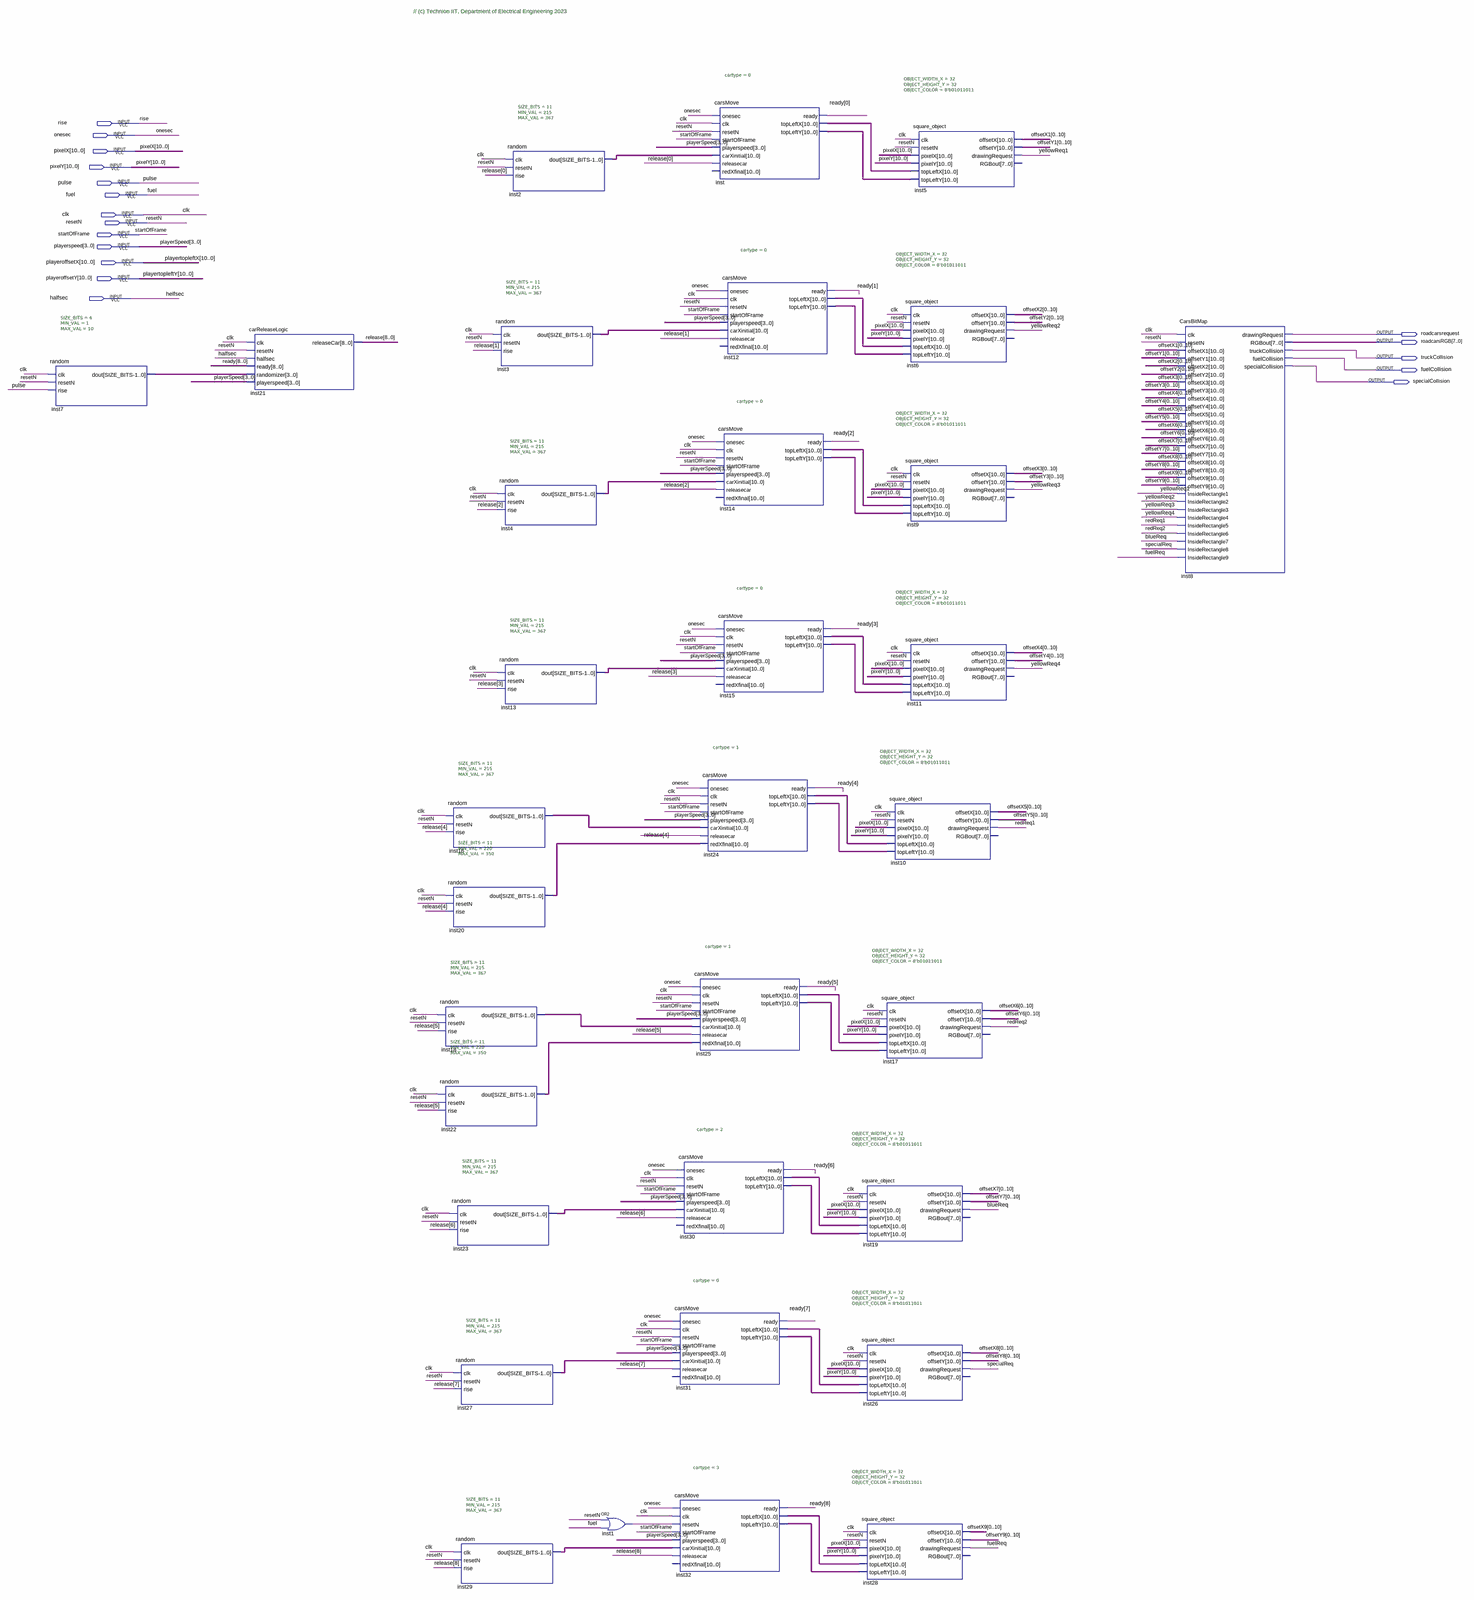
[diagram p0: schematic sheet, whole]
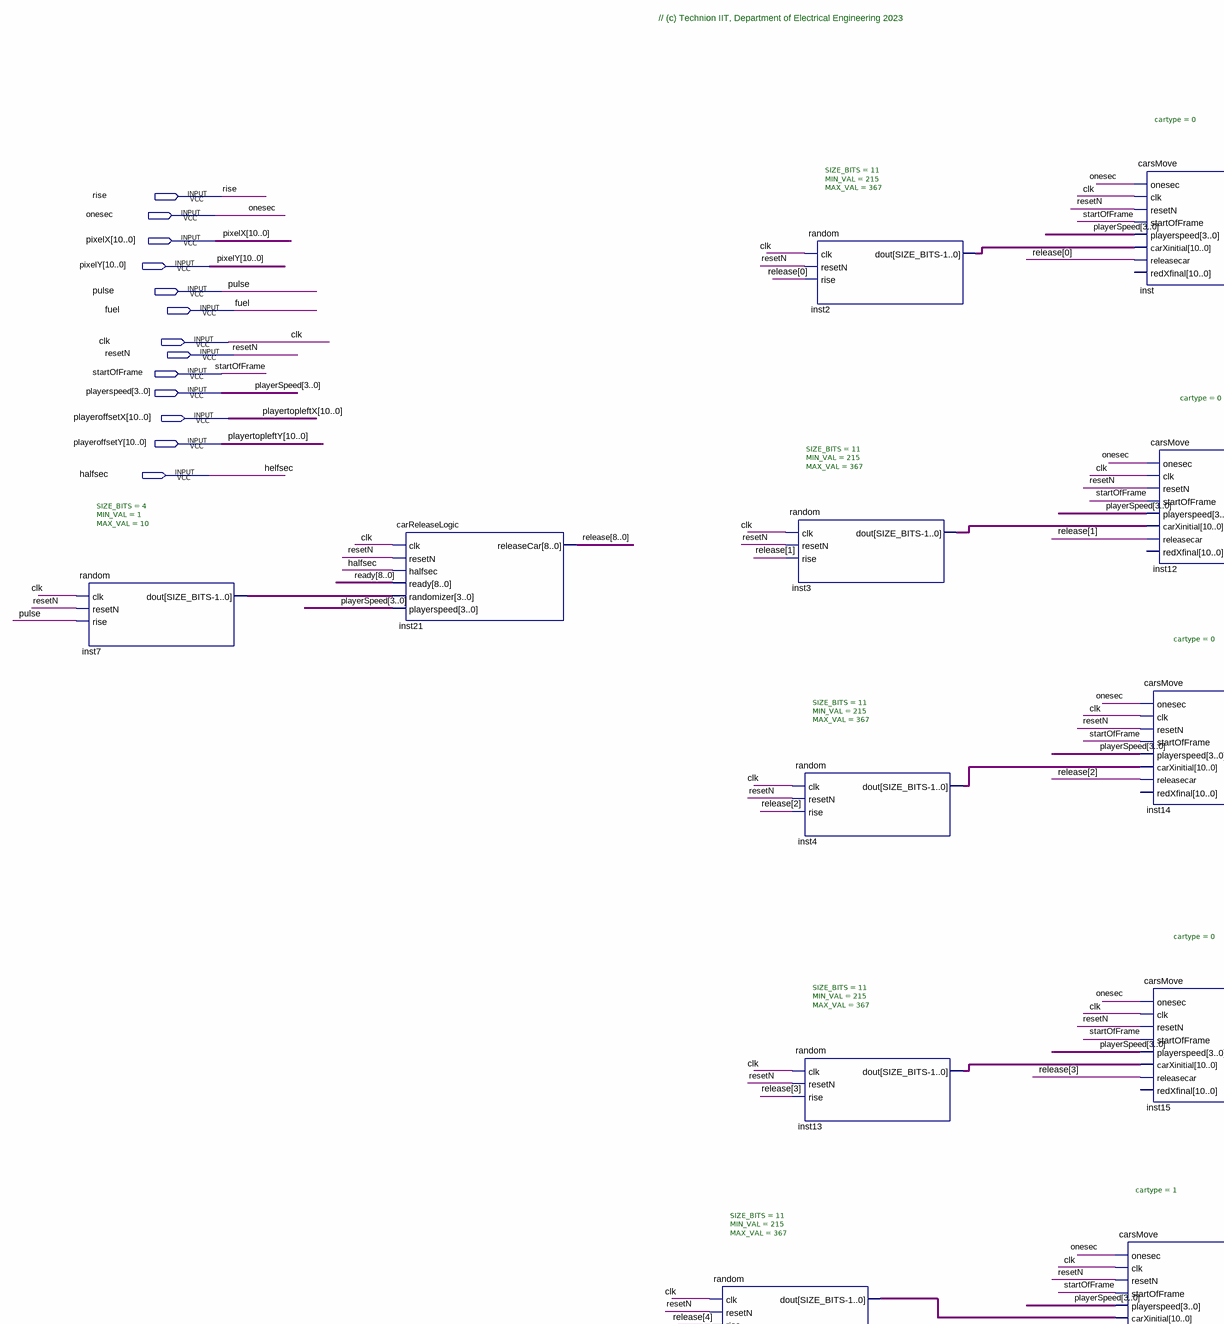
[diagram p1: schematic sheet, upper left part]
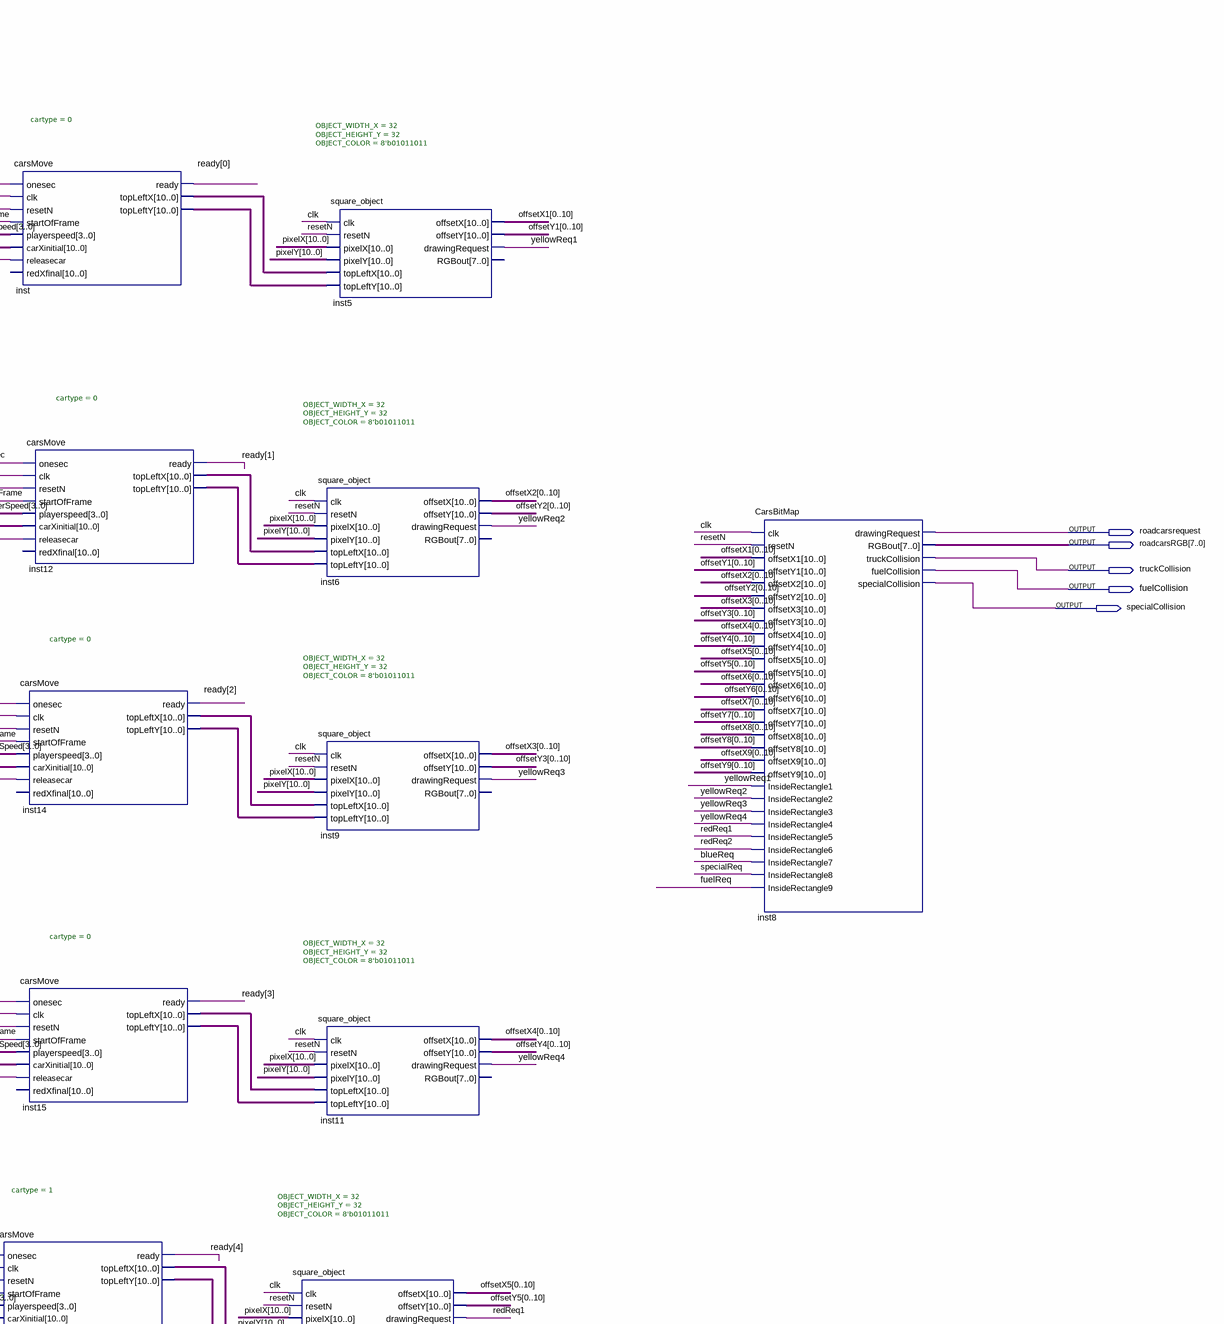
[diagram p2: schematic sheet, upper right part]
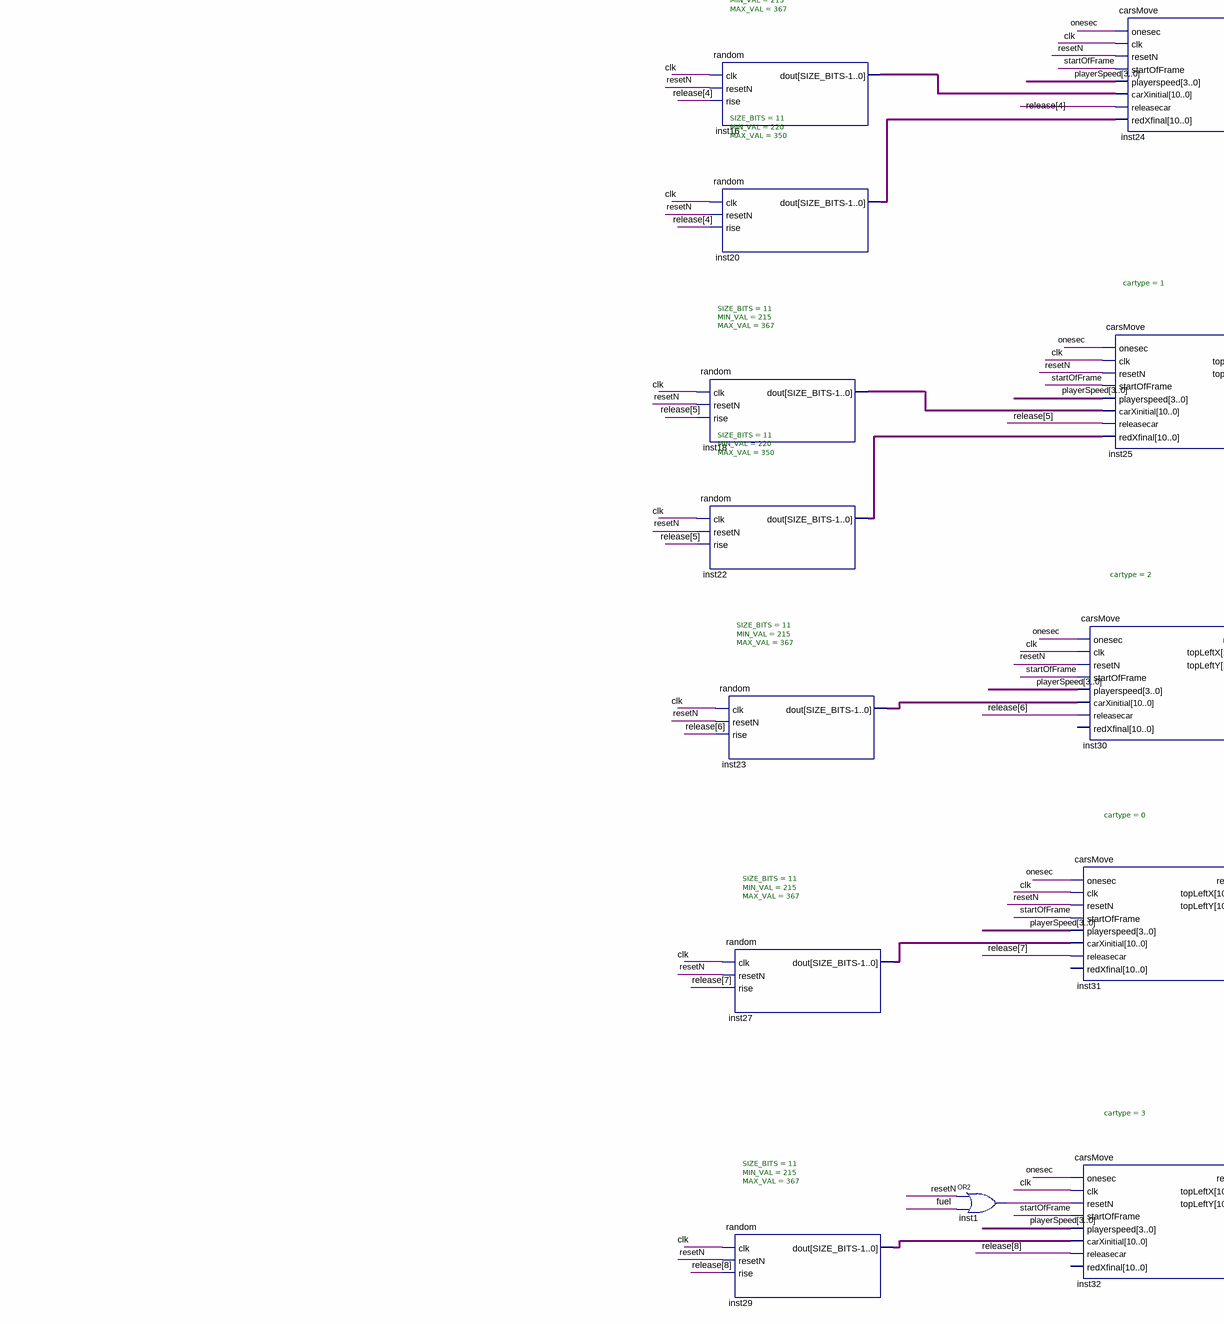
[diagram p3: schematic sheet, lower left part]
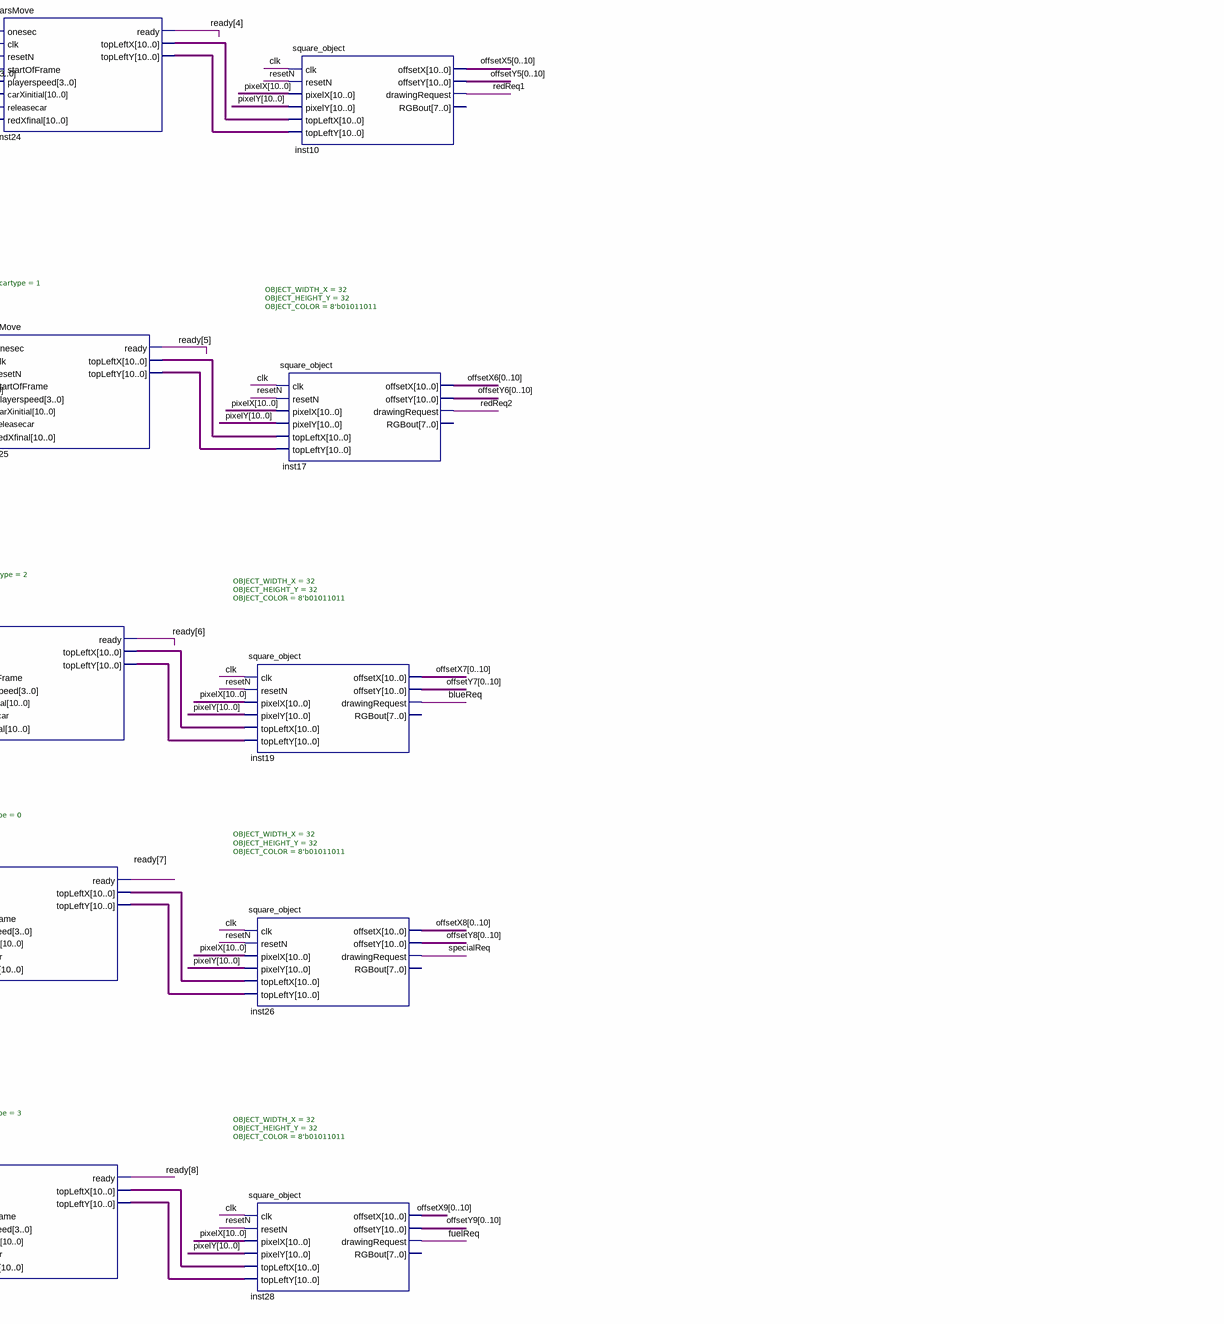
[diagram p4: schematic sheet, lower right part]
// Quartus schematic roadcarsblock.bdf as structural Verilog: 33 symbols, 18 pins
module roadcarsblock (
  input  rise,
  input  onesec,
  input  [10:0] pixelX,
  input  [10:0] pixelY,
  input  pulse,
  input  fuel,
  input  clk,
  input  resetN,
  input  startOfFrame,
  input  [3:0] playerspeed,
  input  [10:0] playeroffsetX,
  input  [10:0] playeroffsetY,
  input  halfsec,
  output roadcarsrequest,
  output [7:0] roadcarsRGB,
  output truckCollision,
  output fuelCollision,
  output specialCollision
);

  wire blueReq, fuelReq, inst1_out, redReq1, redReq2, specialReq, yellowReq1, yellowReq2, yellowReq3,
       yellowReq4;
  wire [3:0] inst7_dout;
  wire [8:0] ready, \release ;
  wire [10:0] inst2_dout, inst3_dout, inst4_dout, inst12_topleftx, inst12_toplefty, inst13_dout,
       inst14_topleftx, inst14_toplefty, inst15_topleftx, inst15_toplefty, inst16_dout, inst18_dout,
       inst20_dout, inst22_dout, inst23_dout, inst24_topleftx, inst24_toplefty, inst25_topleftx,
       inst25_toplefty, inst27_dout, inst29_dout, inst30_topleftx, inst30_toplefty, inst31_topleftx,
       inst31_toplefty, inst32_topleftx, inst32_toplefty, inst_topleftx, inst_toplefty, offsetX1, offsetX2,
       offsetX3, offsetX4, offsetX5, offsetX6, offsetX7, offsetX8, offsetX9, offsetY1, offsetY2, offsetY3,
       offsetY4, offsetY5, offsetY6, offsetY7, offsetY8, offsetY9;

  random #(.SIZE_BITS(4), .MIN_VAL(1), .MAX_VAL(10)) inst7 (
    .clk(clk), .resetN(resetN), .rise(pulse), .dout(inst7_dout));
  carReleaseLogic inst21 (
    .clk(clk), .resetN(resetN), .halfsec(halfsec), .ready(ready), .randomizer(inst7_dout),
    .playerspeed(playerspeed), .releaseCar(\release ));
  random #(.SIZE_BITS(11), .MIN_VAL(215), .MAX_VAL(367)) inst16 (
    .clk(clk), .resetN(resetN), .rise(\release [4]), .dout(inst16_dout));
  random #(.SIZE_BITS(11), .MIN_VAL(220), .MAX_VAL(350)) inst20 (
    .clk(clk), .resetN(resetN), .rise(\release [4]), .dout(inst20_dout));
  random #(.SIZE_BITS(11), .MIN_VAL(215), .MAX_VAL(367)) inst18 (
    .clk(clk), .resetN(resetN), .rise(\release [5]), .dout(inst18_dout));
  random #(.SIZE_BITS(11), .MIN_VAL(220), .MAX_VAL(350)) inst22 (
    .clk(clk), .resetN(resetN), .rise(\release [5]), .dout(inst22_dout));
  random #(.SIZE_BITS(11), .MIN_VAL(215), .MAX_VAL(367)) inst23 (
    .clk(clk), .resetN(resetN), .rise(\release [6]), .dout(inst23_dout));
  random #(.SIZE_BITS(11), .MIN_VAL(215), .MAX_VAL(367)) inst27 (
    .clk(clk), .resetN(resetN), .rise(\release [7]), .dout(inst27_dout));
  random #(.SIZE_BITS(11), .MIN_VAL(215), .MAX_VAL(367)) inst29 (
    .clk(clk), .resetN(resetN), .rise(\release [8]), .dout(inst29_dout));
  random #(.SIZE_BITS(11), .MIN_VAL(215), .MAX_VAL(367)) inst2 (
    .clk(clk), .resetN(resetN), .rise(\release [0]), .dout(inst2_dout));
  random #(.SIZE_BITS(11), .MIN_VAL(215), .MAX_VAL(367)) inst3 (
    .clk(clk), .resetN(resetN), .rise(\release [1]), .dout(inst3_dout));
  random #(.SIZE_BITS(11), .MIN_VAL(215), .MAX_VAL(367)) inst4 (
    .clk(clk), .resetN(resetN), .rise(\release [2]), .dout(inst4_dout));
  random #(.SIZE_BITS(11), .MIN_VAL(215), .MAX_VAL(367)) inst13 (
    .clk(clk), .resetN(resetN), .rise(\release [3]), .dout(inst13_dout));
  or inst1 (inst1_out, resetN, fuel);
  carsMove #(.cartype(2)) inst30 (
    .onesec(onesec), .clk(clk), .resetN(resetN), .startOfFrame(startOfFrame), .playerspeed(playerspeed),
    .carXinitial(inst23_dout), .releasecar(\release [6]), .ready(ready[6]), .topLeftX(inst30_topleftx),
    .topLeftY(inst30_toplefty));  // open: redXfinal
  carsMove #(.cartype(0)) inst31 (
    .onesec(onesec), .clk(clk), .resetN(resetN), .startOfFrame(startOfFrame), .playerspeed(playerspeed),
    .carXinitial(inst27_dout), .releasecar(\release [7]), .ready(ready[7]), .topLeftX(inst31_topleftx),
    .topLeftY(inst31_toplefty));  // open: redXfinal
  carsMove #(.cartype(3)) inst32 (
    .onesec(onesec), .clk(clk), .resetN(inst1_out), .startOfFrame(startOfFrame), .playerspeed(playerspeed),
    .carXinitial(inst29_dout), .releasecar(\release [8]), .ready(ready[8]), .topLeftX(inst32_topleftx),
    .topLeftY(inst32_toplefty));  // open: redXfinal
  carsMove #(.cartype(0)) inst (
    .onesec(onesec), .clk(clk), .resetN(resetN), .startOfFrame(startOfFrame), .playerspeed(playerspeed),
    .carXinitial(inst2_dout), .releasecar(\release [0]), .ready(ready[0]), .topLeftX(inst_topleftx),
    .topLeftY(inst_toplefty));  // open: redXfinal
  carsMove #(.cartype(1)) inst24 (
    .onesec(onesec), .clk(clk), .resetN(resetN), .startOfFrame(startOfFrame), .playerspeed(playerspeed),
    .carXinitial(inst16_dout), .releasecar(\release [4]), .redXfinal(inst20_dout), .ready(ready[4]),
    .topLeftX(inst24_topleftx), .topLeftY(inst24_toplefty));
  carsMove #(.cartype(1)) inst25 (
    .onesec(onesec), .clk(clk), .resetN(resetN), .startOfFrame(startOfFrame), .playerspeed(playerspeed),
    .carXinitial(inst18_dout), .releasecar(\release [5]), .redXfinal(inst22_dout), .ready(ready[5]),
    .topLeftX(inst25_topleftx), .topLeftY(inst25_toplefty));
  carsMove #(.cartype(0)) inst12 (
    .onesec(onesec), .clk(clk), .resetN(resetN), .startOfFrame(startOfFrame), .playerspeed(playerspeed),
    .carXinitial(inst3_dout), .releasecar(\release [1]), .ready(ready[1]), .topLeftX(inst12_topleftx),
    .topLeftY(inst12_toplefty));  // open: redXfinal
  carsMove #(.cartype(0)) inst14 (
    .onesec(onesec), .clk(clk), .resetN(resetN), .startOfFrame(startOfFrame), .playerspeed(playerspeed),
    .carXinitial(inst4_dout), .releasecar(\release [2]), .ready(ready[2]), .topLeftX(inst14_topleftx),
    .topLeftY(inst14_toplefty));  // open: redXfinal
  carsMove #(.cartype(0)) inst15 (
    .onesec(onesec), .clk(clk), .resetN(resetN), .startOfFrame(startOfFrame), .playerspeed(playerspeed),
    .carXinitial(inst13_dout), .releasecar(\release [3]), .ready(ready[3]), .topLeftX(inst15_topleftx),
    .topLeftY(inst15_toplefty));  // open: redXfinal
  square_object #(.OBJECT_WIDTH_X(32), .OBJECT_HEIGHT_Y(32), .OBJECT_COLOR(8'b01011011)) inst19 (
    .clk(clk), .resetN(resetN), .pixelX(pixelX), .pixelY(pixelY), .topLeftX(inst30_topleftx),
    .topLeftY(inst30_toplefty),
    .offsetX({offsetX7[0], offsetX7[1], offsetX7[2], offsetX7[3], offsetX7[4], offsetX7[5], offsetX7[6], offsetX7[7], offsetX7[8], offsetX7[9], offsetX7[10]}),
    .offsetY({offsetY7[0], offsetY7[1], offsetY7[2], offsetY7[3], offsetY7[4], offsetY7[5], offsetY7[6], offsetY7[7], offsetY7[8], offsetY7[9], offsetY7[10]}),
    .drawingRequest(blueReq));  // open: RGBout
  square_object #(.OBJECT_WIDTH_X(32), .OBJECT_HEIGHT_Y(32), .OBJECT_COLOR(8'b01011011)) inst26 (
    .clk(clk), .resetN(resetN), .pixelX(pixelX), .pixelY(pixelY), .topLeftX(inst31_topleftx),
    .topLeftY(inst31_toplefty),
    .offsetX({offsetX8[0], offsetX8[1], offsetX8[2], offsetX8[3], offsetX8[4], offsetX8[5], offsetX8[6], offsetX8[7], offsetX8[8], offsetX8[9], offsetX8[10]}),
    .offsetY({offsetY8[0], offsetY8[1], offsetY8[2], offsetY8[3], offsetY8[4], offsetY8[5], offsetY8[6], offsetY8[7], offsetY8[8], offsetY8[9], offsetY8[10]}),
    .drawingRequest(specialReq));  // open: RGBout
  square_object #(.OBJECT_WIDTH_X(32), .OBJECT_HEIGHT_Y(32), .OBJECT_COLOR(8'b01011011)) inst28 (
    .clk(clk), .resetN(resetN), .pixelX(pixelX), .pixelY(pixelY), .topLeftX(inst32_topleftx),
    .topLeftY(inst32_toplefty),
    .offsetX({offsetX9[0], offsetX9[1], offsetX9[2], offsetX9[3], offsetX9[4], offsetX9[5], offsetX9[6], offsetX9[7], offsetX9[8], offsetX9[9], offsetX9[10]}),
    .offsetY({offsetY9[0], offsetY9[1], offsetY9[2], offsetY9[3], offsetY9[4], offsetY9[5], offsetY9[6], offsetY9[7], offsetY9[8], offsetY9[9], offsetY9[10]}),
    .drawingRequest(fuelReq));  // open: RGBout
  square_object #(.OBJECT_WIDTH_X(32), .OBJECT_HEIGHT_Y(32), .OBJECT_COLOR(8'b01011011)) inst6 (
    .clk(clk), .resetN(resetN), .pixelX(pixelX), .pixelY(pixelY), .topLeftX(inst12_topleftx),
    .topLeftY(inst12_toplefty),
    .offsetX({offsetX2[0], offsetX2[1], offsetX2[2], offsetX2[3], offsetX2[4], offsetX2[5], offsetX2[6], offsetX2[7], offsetX2[8], offsetX2[9], offsetX2[10]}),
    .offsetY({offsetY2[0], offsetY2[1], offsetY2[2], offsetY2[3], offsetY2[4], offsetY2[5], offsetY2[6], offsetY2[7], offsetY2[8], offsetY2[9], offsetY2[10]}),
    .drawingRequest(yellowReq2));  // open: RGBout
  square_object #(.OBJECT_WIDTH_X(32), .OBJECT_HEIGHT_Y(32), .OBJECT_COLOR(8'b01011011)) inst9 (
    .clk(clk), .resetN(resetN), .pixelX(pixelX), .pixelY(pixelY), .topLeftX(inst14_topleftx),
    .topLeftY(inst14_toplefty),
    .offsetX({offsetX3[0], offsetX3[1], offsetX3[2], offsetX3[3], offsetX3[4], offsetX3[5], offsetX3[6], offsetX3[7], offsetX3[8], offsetX3[9], offsetX3[10]}),
    .offsetY({offsetY3[0], offsetY3[1], offsetY3[2], offsetY3[3], offsetY3[4], offsetY3[5], offsetY3[6], offsetY3[7], offsetY3[8], offsetY3[9], offsetY3[10]}),
    .drawingRequest(yellowReq3));  // open: RGBout
  square_object #(.OBJECT_WIDTH_X(32), .OBJECT_HEIGHT_Y(32), .OBJECT_COLOR(8'b01011011)) inst11 (
    .clk(clk), .resetN(resetN), .pixelX(pixelX), .pixelY(pixelY), .topLeftX(inst15_topleftx),
    .topLeftY(inst15_toplefty),
    .offsetX({offsetX4[0], offsetX4[1], offsetX4[2], offsetX4[3], offsetX4[4], offsetX4[5], offsetX4[6], offsetX4[7], offsetX4[8], offsetX4[9], offsetX4[10]}),
    .offsetY({offsetY4[0], offsetY4[1], offsetY4[2], offsetY4[3], offsetY4[4], offsetY4[5], offsetY4[6], offsetY4[7], offsetY4[8], offsetY4[9], offsetY4[10]}),
    .drawingRequest(yellowReq4));  // open: RGBout
  square_object #(.OBJECT_WIDTH_X(32), .OBJECT_HEIGHT_Y(32), .OBJECT_COLOR(8'b01011011)) inst10 (
    .clk(clk), .resetN(resetN), .pixelX(pixelX), .pixelY(pixelY), .topLeftX(inst24_topleftx),
    .topLeftY(inst24_toplefty),
    .offsetX({offsetX5[0], offsetX5[1], offsetX5[2], offsetX5[3], offsetX5[4], offsetX5[5], offsetX5[6], offsetX5[7], offsetX5[8], offsetX5[9], offsetX5[10]}),
    .offsetY({offsetY5[0], offsetY5[1], offsetY5[2], offsetY5[3], offsetY5[4], offsetY5[5], offsetY5[6], offsetY5[7], offsetY5[8], offsetY5[9], offsetY5[10]}),
    .drawingRequest(redReq1));  // open: RGBout
  square_object #(.OBJECT_WIDTH_X(32), .OBJECT_HEIGHT_Y(32), .OBJECT_COLOR(8'b01011011)) inst17 (
    .clk(clk), .resetN(resetN), .pixelX(pixelX), .pixelY(pixelY), .topLeftX(inst25_topleftx),
    .topLeftY(inst25_toplefty),
    .offsetX({offsetX6[0], offsetX6[1], offsetX6[2], offsetX6[3], offsetX6[4], offsetX6[5], offsetX6[6], offsetX6[7], offsetX6[8], offsetX6[9], offsetX6[10]}),
    .offsetY({offsetY6[0], offsetY6[1], offsetY6[2], offsetY6[3], offsetY6[4], offsetY6[5], offsetY6[6], offsetY6[7], offsetY6[8], offsetY6[9], offsetY6[10]}),
    .drawingRequest(redReq2));  // open: RGBout
  square_object #(.OBJECT_WIDTH_X(32), .OBJECT_HEIGHT_Y(32), .OBJECT_COLOR(8'b01011011)) inst5 (
    .clk(clk), .resetN(resetN), .pixelX(pixelX), .pixelY(pixelY), .topLeftX(inst_topleftx),
    .topLeftY(inst_toplefty),
    .offsetX({offsetX1[0], offsetX1[1], offsetX1[2], offsetX1[3], offsetX1[4], offsetX1[5], offsetX1[6], offsetX1[7], offsetX1[8], offsetX1[9], offsetX1[10]}),
    .offsetY({offsetY1[0], offsetY1[1], offsetY1[2], offsetY1[3], offsetY1[4], offsetY1[5], offsetY1[6], offsetY1[7], offsetY1[8], offsetY1[9], offsetY1[10]}),
    .drawingRequest(yellowReq1));  // open: RGBout
  CarsBitMap inst8 (
    .clk(clk), .resetN(resetN),
    .offsetX1({offsetX1[0], offsetX1[1], offsetX1[2], offsetX1[3], offsetX1[4], offsetX1[5], offsetX1[6], offsetX1[7], offsetX1[8], offsetX1[9], offsetX1[10]}),
    .offsetY1({offsetY1[0], offsetY1[1], offsetY1[2], offsetY1[3], offsetY1[4], offsetY1[5], offsetY1[6], offsetY1[7], offsetY1[8], offsetY1[9], offsetY1[10]}),
    .offsetX2({offsetX2[0], offsetX2[1], offsetX2[2], offsetX2[3], offsetX2[4], offsetX2[5], offsetX2[6], offsetX2[7], offsetX2[8], offsetX2[9], offsetX2[10]}),
    .offsetY2({offsetY2[0], offsetY2[1], offsetY2[2], offsetY2[3], offsetY2[4], offsetY2[5], offsetY2[6], offsetY2[7], offsetY2[8], offsetY2[9], offsetY2[10]}),
    .offsetX3({offsetX3[0], offsetX3[1], offsetX3[2], offsetX3[3], offsetX3[4], offsetX3[5], offsetX3[6], offsetX3[7], offsetX3[8], offsetX3[9], offsetX3[10]}),
    .offsetY3({offsetY3[0], offsetY3[1], offsetY3[2], offsetY3[3], offsetY3[4], offsetY3[5], offsetY3[6], offsetY3[7], offsetY3[8], offsetY3[9], offsetY3[10]}),
    .offsetX4({offsetX4[0], offsetX4[1], offsetX4[2], offsetX4[3], offsetX4[4], offsetX4[5], offsetX4[6], offsetX4[7], offsetX4[8], offsetX4[9], offsetX4[10]}),
    .offsetY4({offsetY4[0], offsetY4[1], offsetY4[2], offsetY4[3], offsetY4[4], offsetY4[5], offsetY4[6], offsetY4[7], offsetY4[8], offsetY4[9], offsetY4[10]}),
    .offsetX5({offsetX5[0], offsetX5[1], offsetX5[2], offsetX5[3], offsetX5[4], offsetX5[5], offsetX5[6], offsetX5[7], offsetX5[8], offsetX5[9], offsetX5[10]}),
    .offsetY5({offsetY5[0], offsetY5[1], offsetY5[2], offsetY5[3], offsetY5[4], offsetY5[5], offsetY5[6], offsetY5[7], offsetY5[8], offsetY5[9], offsetY5[10]}),
    .offsetX6({offsetX6[0], offsetX6[1], offsetX6[2], offsetX6[3], offsetX6[4], offsetX6[5], offsetX6[6], offsetX6[7], offsetX6[8], offsetX6[9], offsetX6[10]}),
    .offsetY6({offsetY6[0], offsetY6[1], offsetY6[2], offsetY6[3], offsetY6[4], offsetY6[5], offsetY6[6], offsetY6[7], offsetY6[8], offsetY6[9], offsetY6[10]}),
    .offsetX7({offsetX7[0], offsetX7[1], offsetX7[2], offsetX7[3], offsetX7[4], offsetX7[5], offsetX7[6], offsetX7[7], offsetX7[8], offsetX7[9], offsetX7[10]}),
    .offsetY7({offsetY7[0], offsetY7[1], offsetY7[2], offsetY7[3], offsetY7[4], offsetY7[5], offsetY7[6], offsetY7[7], offsetY7[8], offsetY7[9], offsetY7[10]}),
    .offsetX8({offsetX8[0], offsetX8[1], offsetX8[2], offsetX8[3], offsetX8[4], offsetX8[5], offsetX8[6], offsetX8[7], offsetX8[8], offsetX8[9], offsetX8[10]}),
    .offsetY8({offsetY8[0], offsetY8[1], offsetY8[2], offsetY8[3], offsetY8[4], offsetY8[5], offsetY8[6], offsetY8[7], offsetY8[8], offsetY8[9], offsetY8[10]}),
    .offsetX9({offsetX9[0], offsetX9[1], offsetX9[2], offsetX9[3], offsetX9[4], offsetX9[5], offsetX9[6], offsetX9[7], offsetX9[8], offsetX9[9], offsetX9[10]}),
    .offsetY9({offsetY9[0], offsetY9[1], offsetY9[2], offsetY9[3], offsetY9[4], offsetY9[5], offsetY9[6], offsetY9[7], offsetY9[8], offsetY9[9], offsetY9[10]}),
    .InsideRectangle1(yellowReq1), .InsideRectangle2(yellowReq2), .InsideRectangle3(yellowReq3),
    .InsideRectangle4(yellowReq4), .InsideRectangle5(redReq1), .InsideRectangle6(redReq2),
    .InsideRectangle7(blueReq), .InsideRectangle8(specialReq), .InsideRectangle9(fuelReq),
    .drawingRequest(roadcarsrequest), .RGBout(roadcarsRGB), .truckCollision(truckCollision),
    .fuelCollision(fuelCollision), .specialCollision(specialCollision));

  // Other names for the same wires on the sheet: helfsec = halfsec; playertopleftX[10:0] = playeroffsetX;
  //   playertopleftY[10:0] = playeroffsetY

  // Notes on the sheet:
  //   // (c) Technion IIT, Department of Electrical Engineering 2023
endmodule
